# Altium schematic sheet Power_Supply.SchDoc: Power Supply
size A3; Author: M.Beldyga; CompanyName: WUT ISE; DrawnBy: M.Beldyga; Organization: WUT ISE; Address1: PW ISE; Address2: Nowowiejska 15/19 00-665 Warsaw; Address3: micbeldyga@gmail.com; SheetNumber: 2; SheetTotal: 7; ModifiedBy: -; CheckedDate: -; Title2: +/- 2kV, +/- 15V, 5V; DivGrp: WUT ISE; Designer: M.Beldyga; ModifiedDate: -; ProjectName: Sensor Box
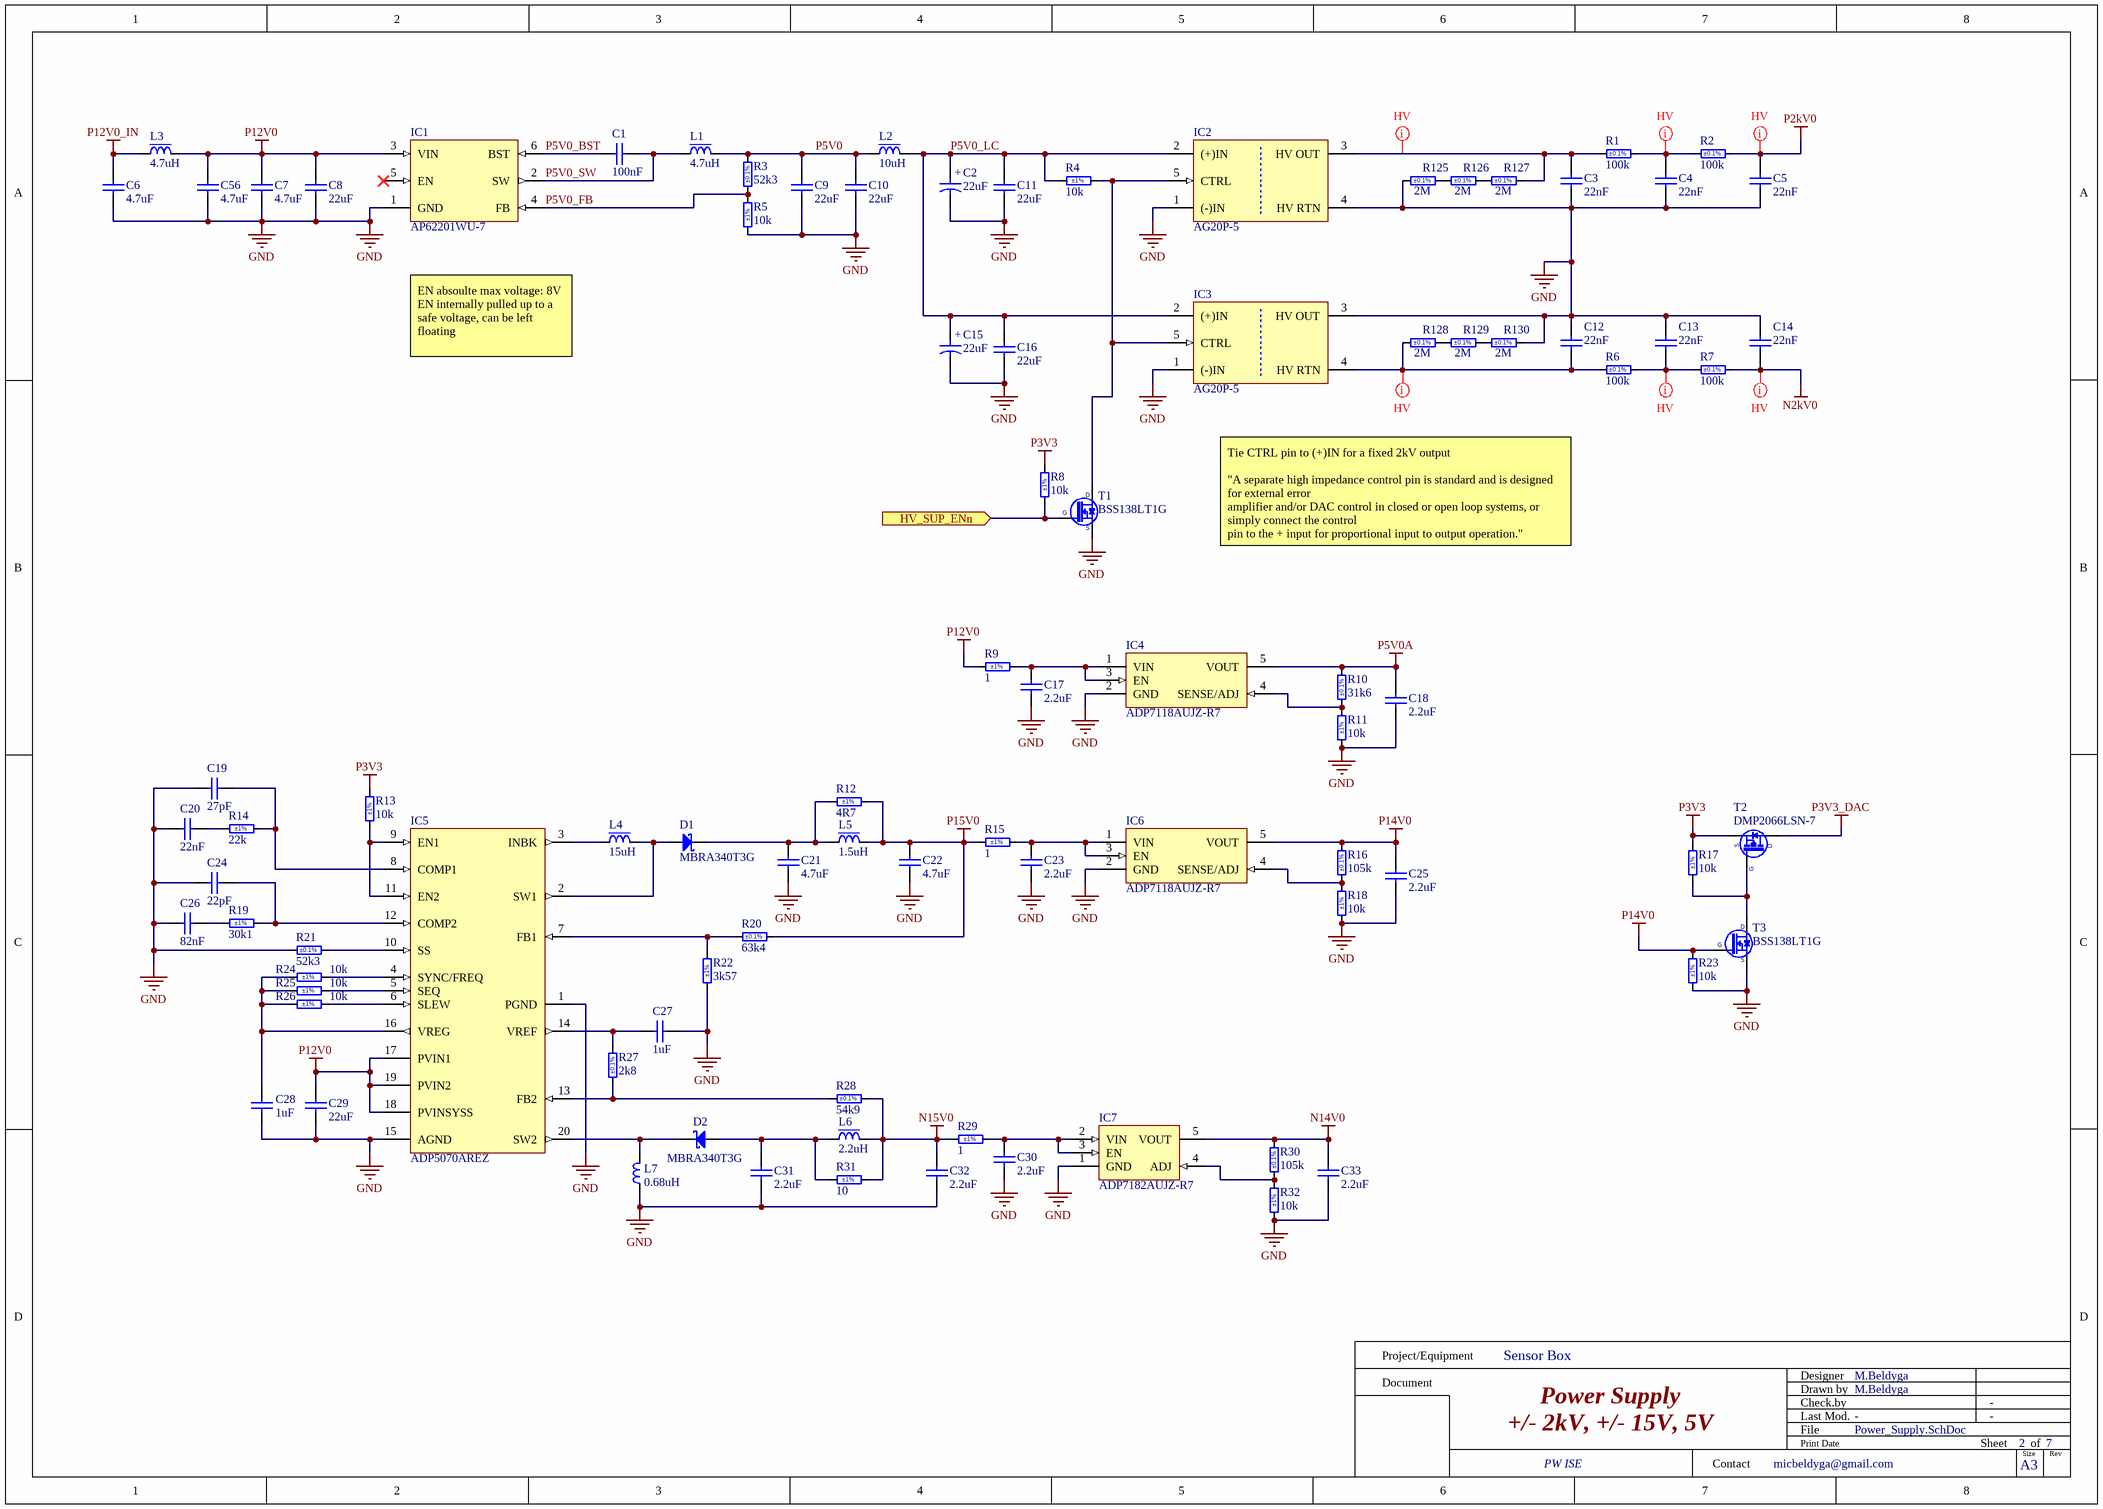
[diagram p0: Power_Supply.SchDoc]

## Parts
C1  100nF  [CAPC1005X55N]
C2  22uF  [CAPMP3528X210N]
C3  22nF  [CAPC5764X279N]
C4  22nF  [CAPC5764X279N]
C5  22nF  [CAPC5764X279N]
C6  4.7uF  [CAPC2012X145N]
C7  4.7uF  [CAPC2012X145N]
C8  22uF  [CAPC3216X180N]
C9  22uF  [CAPC2012X135N]
C10  22uF  [CAPC2012X135N]
C11  22uF  [CAPC3216X180N]
C12  22nF  [CAPC5764X279N]
C13  22nF  [CAPC5764X279N]
C14  22nF  [CAPC5764X279N]
C15  22uF  [CAPMP3528X210N]
C16  22uF  [CAPC3216X180N]
C17  2.2uF  [CAPC1005X55N]
C18  2.2uF  [CAPC1005X55N]
C19  27pF  [CAPC1005X55N]
C20  22nF  [CAPC1005X55N]
C21  4.7uF  [CAPC2012X145N]
C22  4.7uF  [CAPC2012X145N]
C23  2.2uF  [CAPC1005X55N]
C24  22pF  [CAPC1005X55N]
C25  2.2uF  [CAPC1005X55N]
C26  82nF  [CAPC1608X87N]
C27  1uF  [CAPC1005X55N]
C28  1uF  [CAPC1005X55N]
C29  22uF  [CAPC3216X180N]
C30  2.2uF  [CAPC1005X55N]
C31  2.2uF  [CAPC2013X145N]
C32  2.2uF  [CAPC2013X145N]
C33  2.2uF  [CAPC1005X55N]
C56  4.7uF  [CAPC2012X145N]
D1  MBRA340T3G  [DIOM5226X220N]
D2  MBRA340T3G  [DIOM5226X220N]
IC1  AP62201WU-7  [SOT95P280X100-6N]
IC2  AG20P-5  [DCDC_XPPOWER_AG0-2KV]
IC3  AG20P-5  [DCDC_XPPOWER_AG0-2KV]
IC4  ADP7118AUJZ-R7  [SOT95P280X90-5N]
IC5  ADP5070AREZ  [SOP65P640X120-21N-R305X425]
IC6  ADP7118AUJZ-R7  [SOT95P280X90-5N]
IC7  ADP7182AUJZ-R7  [SOT95P280X90-5N]
L1  4.7uH  [IND_WURTH_WE-SPC-4838]
L2  10uH  [IND_BOURNS_PM43]
L3  4.7uH  [IND_WURTH_WE-SPC-4838]
L4  15uH  [IND_WURTH_WE-SPC-4838]
L5  1.5uH  [IND_COILCRAFT_XAL4020]
L6  2.2uH  [IND_MURATA_LQH44PN_P0]
L7  0.68uH  [IND_BOURNS_SRP3212]
R1  100k  Tolerance: ±0.1%  [RESC3216X50N]
R2  100k  Tolerance: ±0.1%  [RESC3216X50N]
R3  52k3  Tolerance: ±0.1%  [RESC1608X55N]
R4  10k  Tolerance: ±1%  [RESC1005X40N]
R5  10k  Tolerance: ±1%  [RESC1005X40N]
R6  100k  Tolerance: ±0.1%  [RESC3216X50N]
R7  100k  Tolerance: ±0.1%  [RESC3216X50N]
R8  10k  Tolerance: ±1%  [RESC1005X40N]
R9  1  Tolerance: ±1%  [RESC1005X40N]
R10  31k6  Tolerance: ±0.1%  [RESC1005X35N]
R11  10k  Tolerance: ±1%  [RESC1005X40N]
R12  4R7  Tolerance: ±1%  [RESC1005X40N]
R13  10k  Tolerance: ±1%  [RESC1005X40N]
R14  22k  Tolerance: ±1%  [RESC1005X40N]
R15  1  Tolerance: ±1%  [RESC1005X40N]
R16  105k  Tolerance: ±0.1%  [RESC1608X55N]
R17  10k  Tolerance: ±1%  [RESC1005X40N]
R18  10k  Tolerance: ±1%  [RESC1005X40N]
R19  30k1  Tolerance: ±1%  [RESC1005X40N]
R20  63k4  Tolerance: ±0.1%  [RESC1608X55N]
R21  52k3  Tolerance: ±0.1%  [RESC1608X55N]
R22  3k57  Tolerance: ±1%  [RESC1608X55N]
R23  10k  Tolerance: ±1%  [RESC1005X40N]
R24  10k  Tolerance: ±1%  [RESC1005X40N]
R25  10k  Tolerance: ±1%  [RESC1005X40N]
R26  10k  Tolerance: ±1%  [RESC1005X40N]
R27  2k8  Tolerance: ±0.1%  [RESC1608X55N]
R28  54k9  Tolerance: ±0.1%  [RESC1608X55N]
R29  1  Tolerance: ±1%  [RESC1005X40N]
R30  105k  Tolerance: ±0.1%  [RESC1608X55N]
R31  10  Tolerance: ±1%  [RESC1005X40N]
R32  10k  Tolerance: ±1%  [RESC1005X40N]
R125  2M  Tolerance: ±0.1%  [RESC5025X65N]
R126  2M  Tolerance: ±0.1%  [RESC5025X65N]
R127  2M  Tolerance: ±0.1%  [RESC5025X65N]
R128  2M  Tolerance: ±0.1%  [RESC5025X65N]
R129  2M  Tolerance: ±0.1%  [RESC5025X65N]
R130  2M  Tolerance: ±0.1%  [RESC5025X65N]
T1  BSS138LT1G  [SOT95P240X110-3N]
T2  DMP2066LSN-7  [SOT95P285X140-3N]
T3  BSS138LT1G  [SOT95P240X110-3N]

## Ports
HV_SUP_ENn (in)

## Nets
GND: C2.2 C3.1 C4.1 C5.1 C6.1 C7.1 C8.1 C9.1 C10.1 C11.1 C12.2 C13.2 C14.2 C15.2 C16.1 C17.1 C18.1 C19.1 C20.1 C21.1 C22.1 C23.1 C24.1 C25.1 C26.1 C27.2 C28.1 C29.1 C30.1 C31.1 C32.1 C33.1 C56.1 IC1.1(GND) IC2.1((-)IN) IC2.4(HV_RTN) IC3.1((-)IN) IC3.3(HV_OUT) IC4.2(GND) IC5.1(PGND) IC5.15(AGND) IC6.2(GND) IC7.1(GND) L7.1 R5.1 R11.1 R18.1 R21.2 R22.1 R23.2 R32.1 R125.1 R130.2 T1.2(S) T3.2(S)
N2kV0: C14.1 R7.2
N14V0: C33.2 IC7.5(VOUT) R30.2
N15V0: C32.2 L6.2 R28.2 R29.1 R31.2
P2kV0: C5.2 R2.2
P3V3: R8.2 R13.2 R17.2 T2.2(S)
P3V3_DAC: T2.3(D)
P5V0A: C18.2 IC4.5(VOUT) R10.2
P12V0: C7.2 C8.2 C29.2 C56.2 IC1.3(VIN) IC5.17(PVIN1) IC5.18(PVINSYSS) IC5.19(PVIN2) L3.2 R9.1
P12V0_IN: C6.2 L3.1
P14V0: C25.2 IC6.5(VOUT) R16.2 R23.1 T3.1(G)
P15V0: C22.2 L5.2 R12.2 R15.1 R20.2
HV_SUP_ENn: R8.1 T1.1(G) ; port HV_SUP_ENn
P5V0: C9.2 C10.2 L1.2 L2.1 R3.2
P5V0_BST: C1.1 IC1.6(BST)
P5V0_FB: IC1.4(FB) R3.1 R5.2
P5V0_LC: C2.1 C11.2 C15.1 C16.2 IC2.2((+)IN) IC3.2((+)IN) L2.2 R4.1
P5V0_SW: C1.2 IC1.2(SW) L1.1
NetC3_2: C3.2 IC2.3(HV_OUT) R1.1 R127.2
NetC4_2: C4.2 R1.2 R2.1
NetC12_1: C12.1 IC3.4(HV_RTN) R6.1 R128.1
NetC13_1: C13.1 R6.2 R7.1
NetC17_2: C17.2 IC4.1(VIN) IC4.3(EN) R9.2
NetC19_2: C19.2 IC5.8(COMP1) R14.2
NetC20_2: C20.2 R14.1
NetC21_2: C21.2 D1.1(C) L5.1 R12.1
NetC23_2: C23.2 IC6.1(VIN) IC6.3(EN) R15.2
NetC24_2: C24.2 IC5.12(COMP2) R19.2
NetC26_2: C26.2 R19.1
NetC27_1: C27.1 IC5.14(VREF) R27.2
NetC28_2: C28.2 IC5.16(VREG) R24.2 R25.2 R26.2
NetC30_2: C30.2 IC7.2(VIN) IC7.3(EN) R29.2
NetC31_2: C31.2 D2.2(A) L6.1 R31.1
NetD1_2: D1.2(A) IC5.2(SW1) L4.2
NetD2_1: D2.1(C) IC5.20(SW2) L7.2
NetIC2_5: IC2.5(CTRL) IC3.5(CTRL) R4.2 T1.3(D)
NetIC4_4: IC4.4(SENSE/ADJ) R10.1 R11.2
NetIC5_3: IC5.3(INBK) L4.1
NetIC5_4: IC5.4(SYNC/FREQ) R24.1
NetIC5_5: IC5.5(SEQ) R25.1
NetIC5_6: IC5.6(SLEW) R26.1
NetIC5_7: IC5.7(FB1) R20.1 R22.2
NetIC5_9: IC5.9(EN1) IC5.11(EN2) R13.1
NetIC5_10: IC5.10(SS) R21.1
NetIC5_13: IC5.13(FB2) R27.1 R28.1
NetIC6_4: IC6.4(SENSE/ADJ) R16.1 R18.2
NetIC7_4: IC7.4(ADJ) R30.1 R32.2
NetR17_1: R17.1 T2.1(G) T3.3(D)
NetR125_2: R125.2 R126.1
NetR126_2: R126.2 R127.1
NetR128_2: R128.2 R129.1
NetR129_2: R129.2 R130.1

Not connected (* = marked no-connect by the designer): IC1 5(EN)*

## Layout directives
net class HV: N2kV0, NetC3_2, NetC4_2, NetC12_1, NetC13_1, P2kV0

## Notes on the sheet
- EN absoulte max voltage: 8V
  EN internally pulled up to a safe voltage, can be left floating
- Tie CTRL pin to (+)IN for a fixed 2kV output
  "A separate high impedance control pin is standard and is designed for external error
  amplifier and/or DAC control in closed or open loop systems, or simply connect the control
  pin to the + input for proportional input to output operation."
- Project/Equipment
- Document
- Designer
- Drawn by
- Check.by
- Contact
- File
- Last Mod.
- Print Date
- Sheet
- Size
- A3
- of
- Rev
- (in symbol CTE3528-21_22UF_20V_10%) +

## Library data of the parts
C1 = CC0402_100NF_50V_10%_X7R: Non-polarised capacitor; Part Description: SMD Multilayer Chip Ceramic Capacitor; Manufacturer: GENERIC; Manufacturer1 Part Number: GRM155R71H104KE14D; Voltage: 50V; TC: X7R; Tolerance: ±10%; Part Number: CC0402_100NF_50V_10%_X7R; Component Kind: Standard; Component Type: Standard; Pin Count: 2; Value: 100nF; Status: None; Manufacturer Part Number: CC0402_100NF_50V_10%_X7R; Case: 0402; Mounted: Yes; Socket: No; SMD: Yes; Sense: No; Manufacturer1 Example: MURATA; Manufacturer1 ComponentHeight: 0.55mm; HelpURL: \\cern.ch\dfs\Applications\Altium\Datasheets\CC0402_MURATA_GRM155R71H104KE14D.pdf; Author: CERN DEM MR; CreateDate: 6/30/2017; LatestRevisionDate: 6/30/2017
C2 C15 = CTE3528-21_22UF_20V_10%: Polarised capacitor; Part Description: Solid Tantalum Chip Capacitor; Manufacturer: GENERIC; Manufacturer1 Part Number: TAJB226K020R; Voltage: 20V; Tolerance: ±10%; Part Number: CTE3528-21_22UF_20V_10%; Component Kind: Standard; Component Type: Standard; Pin Count: 2; Value: 22uF; Status: Preferred; Manufacturer Part Number: CTE3528-21_22UF_20V_10%; Case: B; Mounted: Yes; Socket: No; SMD: Yes; Sense: No; Manufacturer1 Example: AVX; Manufacturer1 ComponentHeight: 2.1mm; HelpURL: \\cern.ch\dfs\Applications\Altium\Datasheets\CTE_AVX_TAJ.pdf; Author: CERN DEM JLC; CreateDate: 12/3/2007; LatestRevisionDate: 12/3/2007
C3-C5 C12-C14 = CC2225_22NF_2.5KV_10%_X7R: Non-polarised capacitor; Part Description: High Voltage MLC Chip Capacitor; Manufacturer: GENERIC; Manufacturer1 Part Number: 2225WC223KAT1A; Voltage: 2.5KV; TC: X7R; Tolerance: ±10%; Part Number: CC2225_22NF_2.5KV_10%_X7R; Component Kind: Standard; Component Type: Standard; Pin Count: 2; Value: 22nF; Status: None; Manufacturer Part Number: CC2225_22NF_2.5KV_10%_X7R; Case: 2225; Mounted: Yes; Socket: No; SMD: Yes; Sense: No; Manufacturer1 Example: AVX; Manufacturer1 ComponentHeight: 2.79mm; HelpURL: \\cern.ch\dfs\Applications\Altium\Datasheets\CC2225_X7R_AVX_HV-MLC.pdf; Author: CERN DEM JLC; CreateDate: 10/21/2014; LatestRevisionDate: 4/1/2015
C6 C7 C21 C22 C56 = CC0805_4.7UF_50V_10%_X7R: Non-polarised capacitor; Part Description: SMD Multilayer Chip Ceramic Capacitor; Manufacturer: GENERIC; Manufacturer1 Part Number: C2012X7R1H475K125; Voltage: 50V; TC: X7R; Tolerance: ±10%; Part Number: CC0805_4.7UF_50V_10%_X7R; Component Kind: Standard; Component Type: Standard; Pin Count: 2; Value: 4.7uF; Status: Preferred; Manufacturer Part Number: CC0805_4.7UF_50V_10%_X7R; Case: 0805; Mounted: Yes; Socket: No; SMD: Yes; Sense: No; Manufacturer1 Example: TDK; Manufacturer1 ComponentHeight: 1.45mm; HelpURL: \\cern.ch\dfs\Applications\Altium\Datasheets\CC0805_X7R_TDK_C.pdf; Author: CERN DEM JMW; CreateDate: 7/30/2021; LatestRevisionDate: 7/30/2021
C8 C11 C16 C29 = CC1206_22UF_25V_20%_X5R: Non-polarised capacitor; Part Description: SMD Multilayer Chip Ceramic Capacitor; Manufacturer: GENERIC; Manufacturer1 Part Number: C3216X5R1E226M160; Voltage: 25V; TC: X5R; Tolerance: ±20%; Part Number: CC1206_22UF_25V_20%_X5R; Component Kind: Standard; Component Type: Standard; Pin Count: 2; Value: 22uF; Status: None; Manufacturer Part Number: CC1206_22UF_25V_20%_X5R; Case: 1206; Mounted: Yes; Socket: No; SMD: Yes; Sense: No; Manufacturer1 Example: TDK; Manufacturer1 ComponentHeight: 1.8mm; HelpURL: \\cern.ch\dfs\Applications\Altium\Datasheets\CC1206_X5R_TDK_C.pdf; Author: CERN DEM WB; CreateDate: 7/25/2018; LatestRevisionDate: 7/25/2018
C9 C10 = CC0805_22UF_16V_10%_X5R: Non-polarised capacitor; Part Description: SMD Multilayer Chip Ceramic Capacitor; Manufacturer: GENERIC; Manufacturer1 Part Number: C2012X5R1C226KT; Voltage: 16V; TC: X5R; Tolerance: ±10%; Part Number: CC0805_22UF_16V_10%_X5R; Component Kind: Standard; Component Type: Standard; Pin Count: 2; Value: 22uF; Status: Preferred; Manufacturer Part Number: CC0805_22UF_16V_10%_X5R; Case: 0805; Mounted: Yes; Socket: No; SMD: Yes; Sense: No; Manufacturer1 Example: TDK; Manufacturer1 ComponentHeight: 1.35mm; HelpURL: \\cern.ch\dfs\Applications\Altium\Datasheets\CC0805_X5R_TDK_C.pdf; Author: CERN DEM JLC; CreateDate: 10/25/2012; LatestRevisionDate: 10/25/2012
C17 C18 C23 C25 C30 C33 = CC0402_2.2UF_16V_10%_X5R: Non-polarised capacitor; Part Description: SMD Multilayer Chip Ceramic Capacitor; Manufacturer: GENERIC; Manufacturer1 Part Number: C1005X5R1C225K050; Voltage: 16V; TC: X5R; Tolerance: ±10%; Part Number: CC0402_2.2UF_16V_10%_X5R; Component Kind: Standard; Component Type: Standard; Pin Count: 2; Value: 2.2uF; Status: Preferred; Manufacturer Part Number: CC0402_2.2UF_16V_10%_X5R; Case: 0402; Mounted: Yes; Socket: No; SMD: Yes; Sense: No; Manufacturer1 Example: TDK; Manufacturer1 ComponentHeight: 0.55mm; HelpURL: \\cern.ch\dfs\Applications\Altium\Datasheets\CC0402_X5R_TDK_C.pdf; Author: CERN DEM BC; CreateDate: 2/8/2021; LatestRevisionDate: 2/8/2021
C19 = CC0402_27PF_50V_5%_C0G: Non-polarised capacitor; Part Description: SMD Multilayer Chip Ceramic Capacitor; Manufacturer: GENERIC; Manufacturer1 Part Number: C0402C270J5GACTU; Voltage: 50V; TC: C0G/NP0; Tolerance: ±5%; Part Number: CC0402_27PF_50V_5%_C0G; Component Kind: Standard; Component Type: Standard; Pin Count: 2; Value: 27pF; Status: Preferred; Manufacturer Part Number: CC0402_27PF_50V_5%_C0G; Case: 0402; Mounted: Yes; Socket: No; SMD: Yes; Sense: No; Manufacturer1 Example: KEMET; Manufacturer1 ComponentHeight: 0.55mm; HelpURL: \\cern.ch\dfs\Applications\Altium\Datasheets\CC0402_C0G_KEMET_(Commercial Grade).pdf; Author: CERN DEM JLC; CreateDate: 10/25/2012; LatestRevisionDate: 4/22/2015
C20 = CC0402_22NF_16V_10%_X7R: Non-polarised capacitor; Part Description: SMD Multilayer Chip Ceramic Capacitor; Manufacturer: GENERIC; Manufacturer1 Part Number: 223878715641; Voltage: 16V; TC: X7R; Tolerance: ±10%; Part Number: CC0402_22NF_16V_10%_X7R; Component Kind: Standard; Component Type: Standard; Pin Count: 2; Value: 22nF; Status: Not Recommended; Manufacturer Part Number: CC0402_22NF_16V_10%_X7R; Case: 0402; Mounted: Yes; Socket: No; SMD: Yes; Sense: No; Manufacturer1 Example: PHYCOMP; Manufacturer1 ComponentHeight: 0.55mm; HelpURL: \\cern.ch\dfs\Applications\Altium\Datasheets\CC0402_X7R_PHYCOMP.pdf; Author: CERN DEM JLC; CreateDate: 12/3/2007; LatestRevisionDate: 12/3/2007
C24 = CC0402_22PF_50V_5%_C0G: Non-polarised capacitor; Part Description: SMD Multilayer Chip Ceramic Capacitor; Manufacturer: GENERIC; Manufacturer1 Part Number: C0402C220J5GACTU; Voltage: 50V; TC: C0G/NP0; Tolerance: ±5%; Part Number: CC0402_22PF_50V_5%_C0G; Component Kind: Standard; Component Type: Standard; Pin Count: 2; Value: 22pF; Status: Preferred; Manufacturer Part Number: CC0402_22PF_50V_5%_C0G; Case: 0402; Mounted: Yes; Socket: No; SMD: Yes; Sense: No; Manufacturer1 Example: KEMET; Manufacturer1 ComponentHeight: 0.55mm; HelpURL: \\cern.ch\dfs\Applications\Altium\Datasheets\CC0402_C0G_KEMET_(Commercial Grade).pdf; Author: CERN DEM JLC; CreateDate: 12/3/2007; LatestRevisionDate: 12/3/2007
C26 = CC0603_82NF_16V_10%_X7R: Non-polarised capacitor; Part Description: SMD Multilayer Chip Ceramic Capacitor; Manufacturer: GENERIC; Manufacturer1 Part Number: 223878615648; Voltage: 16V; TC: X7R; Tolerance: ±10%; Part Number: CC0603_82NF_16V_10%_X7R; Component Kind: Standard; Component Type: Standard; Pin Count: 2; Value: 82nF; Status: Preferred; Manufacturer Part Number: CC0603_82NF_16V_10%_X7R; Case: 0603; Mounted: Yes; Socket: No; SMD: Yes; Sense: No; Manufacturer1 Example: PHYCOMP; Manufacturer1 ComponentHeight: 0.87mm; HelpURL: \\cern.ch\dfs\Applications\Altium\Datasheets\CC0603_X7R_PHYCOMP.pdf; Author: CERN DEM JLC; CreateDate: 12/3/2007; LatestRevisionDate: 12/3/2007
C27 C28 = CC0402_1UF_16V_10%_X5R: Non-polarised capacitor; Part Description: SMD Multilayer Chip Ceramic Capacitor; Manufacturer: GENERIC; Manufacturer1 Part Number: C1005X5R1C105KT; Voltage: 16V; TC: X5R; Tolerance: ±10%; Part Number: CC0402_1UF_16V_10%_X5R; Component Kind: Standard; Component Type: Standard; Pin Count: 2; Value: 1uF; Status: Preferred; Manufacturer Part Number: CC0402_1UF_16V_10%_X5R; Case: 0402; Mounted: Yes; Socket: No; SMD: Yes; Sense: No; Manufacturer1 Example: TDK; Manufacturer1 ComponentHeight: 0.55mm; HelpURL: \\cern.ch\dfs\Applications\Altium\Datasheets\CC0402_X5R_TDK_C.pdf; Author: CERN DEM JLC
  C27: CreateDate: 10/25/2012; LatestRevisionDate: 10/25/2012
  C28: CreateDate: 25.10.2012; LatestRevisionDate: 25.10.2012
C31 C32 = CC0805_2.2UF_35V_10%_X7R: Non-polarised capacitor; Part Description: SMD Multilayer Chip Ceramic Capacitor; Manufacturer: GENERIC; Manufacturer Part Number: CGA4J1X7R1V225K125; Voltage: 35V; TC: X7R; Tolerance: ±10%; Part Number: CC0805_2.2UF_35V_10%_X7R; Component Kind: Standard; Component Type: Standard; Pin Count: 2; Value: 2.2uF; Status: Preferred; Case: 0805; Mounted: Yes; Socket: No; SMD: Yes; Sense: No; Manufacturer1 Example: TDK; Manufacturer1 Part Number: CGA4J1X7R1V225K125; Manufacturer1 ComponentHeight: 1.45mm; HelpURL: \\cern.ch\dfs\Applications\Altium\Datasheets\CC0805_X7R_TDK_CGA.pdf; Author: CERN DEM HF; CreateDate: 8/26/2022; LatestRevisionDate: 8/26/2022
D1 D2 = MBRA340T3G: Schottky Diode; Part Description: Schottky Power Rectifier; Manufacturer: ON SEMICONDUCTOR; Voltage: 40V; Power: 3A; PressFit: No; Bonding: No; Part Number: MBRA340T3G; Component Kind: Standard; Component Type: Standard; Device: MBRA340T3G; PackageDescription: DO-214-AC/SMA Diode, Molded Body; 5.21mm L X 2.60mm W X 2.20mm H, IPC Medium Density; Manufacturer Part Number: MBRA340T3; Pin Count: 2; Case: DO-214AC; Mounted: Yes; Socket: No; SMD: Yes; Sense: No; ComponentHeight: 2.20mm; HelpURL: \\cern.ch\dfs\Applications\Altium\Datasheets\MBRA340T3G.pdf; Author: CERN DEM JLC; CreateDate: 6/18/2012; LatestRevisionDate: 5/24/2022
IC1 = AP62201WU-7: 4.2V TO 18V INPUT, 2A LOW IQ SYNCHRONOUS BUCK CONVERTER; Manufacturer: DIODES INCORPORATED; PressFit: No; Bonding: No; Part Number: AP62201WU-7; Component Kind: Standard; Component Type: Standard; Device: AP62201WU-7; PackageDescription: SOT23, 0.95mm Pitch; 6 Pin, 1.625mm W X 2.90mm L X 1.00mm H body, IPC Medium Density; Part Description: 4.2V To 18V Input, 2A Low Iq Synchronous Buck Converter; Manufacturer Part Number: AP62201WU; Pin Count: 6; Case: SOT23-6; Mounted: Yes; Socket: No; SMD: Yes; Sense: No; ComponentHeight: 1.1mm; HelpURL: \\cern.ch\dfs\Applications\Altium\Datasheets\AP6220x.pdf; Author: CERN DEM HF; CreateDate: 1/7/2022; LatestRevisionDate: 3/21/2022
IC2 IC3 = AG20P-5: XP POWER, AG Series, DC/HVDC Converter; Part Description: 5VDC to 0-2kVDC, Iout (max) 0.5mA, 1W DC-HVDC Converter; PressFit: No; Bonding: No; Part Number: AG20P-5; Component Kind: Standard; Component Type: Standard; Device: AG20P-5; PackageDescription: AG Series, DC/HVDC Converter, Body W 11.43mm x L 23.37mm x H 6.35mm; Manufacturer: XP POWER; Manufacturer Part Number: AG20P-5; Pin Count: 5; Mounted: Yes; Socket: No; SMD: Yes; Sense: No; ComponentHeight: 3.3mm; HelpURL: \\cern.ch\dfs\Applications\Altium\Datasheets\XPPOWER_AG-Series.pdf; Author: CERN DEM BC; CreateDate: 9/18/2020; LatestRevisionDate: 9/18/2020
IC4 IC6 = ADP7118AUJZ-R7: Adjustable Positive LDO Regulator, 1.2V Min, 20V Max, 0.42V Dropout, CMOS, PDSO5; Manufacturer: Analog Devices; Output Voltage: 19.8V; Output Current: 200mA; Dropout Voltage: 200mV; Number of Regulators: 1; Min Current Limit: 250mA; Input Bias Current: 1uA; Min Input Voltage: 2.7V; Operating Supply Current: 180uA; Power Supply Rejection Ratio (PSRR): 50dB; Accuracy: 0.8%; Quiescent Current: 140uA; Max Output Voltage: 19.58V; Max Supply Current: 320uA; Supplier: Digikey; Supplier Part Number: 505-ADP7118AUJZ-R7CT-ND; Manufacturer Part Number: ADP7118AUJZ-R7; RoHS: Yes; Category: Voltage Regulators - Linear; Stock: 3209; Pricing: 1=2.73, 10=2.033, 25=1.8596, 100=1.6689, 250=1.57808, 500=1.52332, 1000=1.47827 (USD); Mounting Technology: Surface Mount; Case/Package: SOT-23-5; Pins: 5; Contact Plating: Tin,Matte; Min Operating Temperature: -40°C; Max Operating Temperature: 125°C; Packaging: Tape and Reel; Number of Outputs: 1; Max Supply Voltage: 20V; Package Quantity: 3000; Polarity: Positive; Max Output current: 200mA; Output Type: Adjustable; Series: -; Output Configuration: Positive; Min Output Voltage: 1.2V; Lead Free: Contains Lead; RoHS Compliant: Yes; ComponentLink1URL: http://www.farnell.com/datasheets/2250589.pdf?src-supplier=Farnell; ComponentLink1Description: http://www.farnell.com/datasheets/2250589.pdf?src-supplier=Farnell; ComponentLink2URL: http://www.mouser.com/ds/2/609/ADP7118-876130.pdf?src-supplier=Mouser; ComponentLink2Description: http://www.mouser.com/ds/2/609/ADP7118-876130.pdf?src-supplier=Mouser; ComponentLink3URL: https://www.analog.com/media/en/technical-documentation/data-sheets/ADP7118.pdf?src-supplier=Digikey; ComponentLink3Description: https://www.analog.com/media/en/technical-documentation/data-sheets/ADP7118.pdf?src-supplier=Digikey; ComponentLink4URL: http://www.analog.com/static/imported-files/data_sheets/ADP7118.pdf?src-supplier=Avnet; ComponentLink4Description: http://www.analog.com/static/imported-files/data_sheets/ADP7118.pdf?src-supplier=Avnet; ComponentLink5URL: https://datasheet.octopart.com/ADP7118AUJZ-R7-Analog-Devices-datasheet-80865365.pdf?src-supplier=Newark; ComponentLink5Description: https://datasheet.octopart.com/ADP7118AUJZ-R7-Analog-Devices-datasheet-80865365.pdf?src-supplier=Newark; ComponentLink6URL: https://datasheet.octopart.com/ADP7118AUJZ-R7-Analog-Devices-datasheet-140248909.pdf?src-supplier=Element14; ComponentLink6Description: https://datasheet.octopart.com/ADP7118AUJZ-R7-Analog-Devices-datasheet-140248909.pdf?src-supplier=Element14; ComponentLink7URL: https://datasheet.octopart.com/ADP7118AUJZ-R7-Analog-Devices-datasheet-140566823.pdf?src-supplier=Arrow.cn; ComponentLink7Description: https://datasheet.octopart.com/ADP7118AUJZ-R7-Analog-Devices-datasheet-140566823.pdf?src-supplier=Arrow.cn
IC5 = ADP5070AREZ: 1A/0.6A, DC-to-DC Switching Regulator with Independent Positive and Negative Outputs; Manufacturer: ANALOG DEVICES; PressFit: No; Bonding: No; Part Number: ADP5070AREZ; Component Kind: Standard; Component Type: Standard; Device: ADP5070AREZ; PackageDescription: SOP, 0.65mm Pitch; 20 Pin, 4.40mm W X 6.50mm L X 1.20mm H Body (w/Thermal Tab 3.05mm X 4.25mm), IPC Medium Density; Part Description: 1A/0.6A, DC-to-DC Switching Regulator with Independent Positive and Negative Outputs; Manufacturer Part Number: ADP5070ARE; Pin Count: 20; Case: SSOP20; Mounted: Yes; Socket: No; SMD: Yes; Sense: No; ComponentHeight: 1.2mm; HelpURL: \\cern.ch\dfs\Applications\Altium\Datasheets\ADP5070AREZ.pdf; Author: CERN DEM JLC; CreateDate: 6/21/2017; LatestRevisionDate: 4/1/2022
IC7 = ADP7182AUJZ-R7: -1.22V to -27V, -200mA, Adjustable, Low Noise, Negative Linear Regulator; Manufacturer: ANALOG DEVICES; PressFit: No; Bonding: No; Part Number: ADP7182AUJZ-R7; Component Kind: Standard; Component Type: Standard; Device: ADP7182AUJZ-R7; PackageDescription: SOT23, 0.95mm Pitch; 5 Pin, 1.75mm W X 3.00mm L X 0.90mm H body, IPC Medium Density; Part Description: -1.22V to -27V, -200mA, Adjustable, Low Noise, Negative Linear Regulator; Manufacturer Part Number: ADP7182AUJ; Pin Count: 5; Case: SOT23-5; Mounted: Yes; Socket: No; SMD: Yes; Sense: No; ComponentHeight: 0.9mm; HelpURL: \\cern.ch\dfs\Applications\Altium\Datasheets\ADP7182AUJZ-R7.pdf; Author: CERN DEM JLC; CreateDate: 6/16/2014; LatestRevisionDate: 4/4/2022
L1 L3 = IND_4.7UH_20%_WURTH_WE-SPC_74408943047: Inductor With Core; Part Description: SMD Shielded Power Inductor (WE-SPC Series); Manufacturer: WURTH ELEKTRONIK; Power: 2.2A; Resistance: 0.045R; Tolerance: ±20%; Part Number: IND_4.7UH_20%_WURTH_WE-SPC_74408943047; Component Kind: Standard; Component Type: Standard; Pin Count: 2; Value: 4.7uH; Manufacturer Part Number: 74408943047; Mounted: Yes; Socket: No; SMD: Yes; Sense: No; ComponentHeight: 4.1mm; HelpURL: \\cern.ch\dfs\Applications\Altium\Datasheets\IND_WURTH_WE-SPC_74408943047.pdf; Author: CERN DEM JLC; CreateDate: 11/24/2014; LatestRevisionDate: 7/5/2017
L2 = IND_10UH_20%_BOURNS_PM43: Inductor With Core; Part Description: SMD Power Inductor; Manufacturer: BOURNS; Manufacturer Part Number: PM43-100M-RC; Power: 1.15A; Resistance: 0.18R; Tolerance: ±20%; Part Number: IND_10UH_20%_BOURNS_PM43; Component Kind: Standard; Component Type: Standard; Pin Count: 2; Value: 10uH; Mounted: Yes; Socket: No; SMD: Yes; Sense: No; ComponentHeight: 3.5mm; HelpURL: \\cern.ch\dfs\Applications\Altium\Datasheets\IND_BOURNS_PM43.pdf; Author: CERN DEM JLC; CreateDate: 5/17/2011; LatestRevisionDate: 5/17/2011
L4 = IND_15UH_20%_WURTH_WE-SPC_74408943150: Inductor With Core; Part Description: SMD Shielded Power Inductor (WE-SPC Series); Manufacturer: WURTH ELEKTRONIK; Power: 1.4A; Resistance: 0.118R; Tolerance: ±20%; Part Number: IND_15UH_20%_WURTH_WE-SPC_74408943150; Component Kind: Standard; Component Type: Standard; Pin Count: 2; Value: 15uH; Manufacturer Part Number: 74408943150; Mounted: Yes; Socket: No; SMD: Yes; Sense: No; ComponentHeight: 4.1mm; HelpURL: \\cern.ch\dfs\Applications\Altium\Datasheets\IND_WURTH_WE-SPC_74408943150.pdf; Author: CERN DEM MR; CreateDate: 6/30/2017; LatestRevisionDate: 7/5/2017
L5 = IND_1.5UH_20%_COILCRAFT_XAL4020: Inductor With Core; Part Description: SMD Shielded Power Inductor; Manufacturer Part Number: XAL4020-152ME; Power: 5.2A; Resistance: 0.02145R; Tolerance: ±20%; Part Number: IND_1.5UH_20%_COILCRAFT_XAL4020; Component Kind: Standard; Component Type: Standard; Pin Count: 2; Value: 1.5uH; Manufacturer: COILCRAFT; Mounted: Yes; Socket: No; SMD: Yes; Sense: No; ComponentHeight: 2.1mm; HelpURL: \\cern.ch\dfs\Applications\Altium\Datasheets\IND_COILCRAFT_XAL4020.pdf; Author: CERN DEM BC; CreateDate: 8/7/2019; LatestRevisionDate: 8/31/2023
L6 = IND_2.2UH_20%_MURATA_LQH44PN2R2MP0L: Inductor With Core; Part Description: Wire Wound Ferrite Inductor for Power Lines; Manufacturer: MURATA; Power: 1.8A; Resistance: 0R049; Tolerance: ±20%; Part Number: IND_2.2UH_20%_MURATA_LQH44PN2R2MP0L; Component Kind: Standard; Component Type: Standard; Pin Count: 2; Value: 2.2uH; Manufacturer Part Number: LQH44PN2R2MP0L; Case: 4040; Mounted: Yes; Socket: No; SMD: Yes; Sense: No; ComponentHeight: 1.8mm; HelpURL: \\cern.ch\dfs\Applications\Altium\Datasheets\IND_MURATA_LQH44PN_P0.pdf; Author: CERN DEM JLC; CreateDate: 2/14/2018; LatestRevisionDate: 2/14/2018
L7 = IND_0.68UH_20%_BOURNS_SRP3212: Inductor; Part Description: Shielded SMD Power Inductor; Manufacturer: BOURNS; Manufacturer Part Number: SRP3212-R68M; Power: 6.2A; Resistance: 0.020R; Tolerance: ±20%; Part Number: IND_0.68UH_20%_BOURNS_SRP3212; Component Kind: Standard; Component Type: Standard; Pin Count: 2; Value: 0.68uH; Mounted: Yes; Socket: No; SMD: Yes; Sense: No; ComponentHeight: 1.2mm; HelpURL: \\cern.ch\dfs\Applications\Altium\Datasheets\IND_BOURNS_SRP3212.pdf; Author: CERN DEM HF; CreateDate: 6/23/2022; LatestRevisionDate: 6/23/2022
R1 R2 R6 R7 = R1206_100K_0.1%_0.4W_25PPM_VISHAY_PAT: Resistor - 0.1%; Part Description: Precision Automotive Thin Film Chip Resistor 2kV ESD Rating; Manufacturer: VISHAY DALE THIN FILM; Manufacturer Part Number: PAT1206E1003BS; Power: 0.4W; TC: ±25ppm/°C; PressFit: No; Part Number: R1206_100K_0.1%_0.4W_25PPM_VISHAY_PAT; Component Kind: Standard; Component Type: Standard; Pin Count: 2; Value: 100k; Status: Not Recommended; Case: 1206; Mounted: Yes; Sense: No; Socket: No; SMD: Yes; ComponentHeight: 0.5mm; HelpURL: \\cern.ch\dfs\Applications\Altium\Datasheets\R1206_VISHAY_PAT.pdf; Author: CERN DEM MR; CreateDate: 7/19/2016; LatestRevisionDate: 6/28/2022
R3 R21 = R0603_52K3_0.1%_0.063W_10PPM: Resistor - 0.1%; Part Description: Thin Film Chip Resistor; Manufacturer: GENERIC; Manufacturer1 Part Number: RN73C1J52K3BTDF; Power: 0.063W; TC: ±10ppm; PressFit: No; Part Number: R0603_52K3_0.1%_0.063W_10PPM; Component Kind: Standard; Component Type: Standard; Pin Count: 2; Value: 52k3; Status: Not Recommended; Manufacturer Part Number: R0603_52K3_0.1%_0.063W_10PPM; Case: 0603; Mounted: Yes; Sense: No; Socket: No; SMD: Yes; Manufacturer1 Example: TYCO HOLSWORTHY; Manufacturer1 ComponentHeight: 0.5mm; HelpURL: \\cern.ch\dfs\Applications\Altium\Datasheets\R0603_Tyco_RN73.pdf; Author: CERN DEM JLC; CreateDate: 12/3/2007; LatestRevisionDate: 3/13/2008
R4 R5 R8 R11 R13 R17 R18 R23-R26 R32 = R0402_10K_1%_0.0625W_100PPM: Resistor - 1%; Part Description: General Purpose Thick Film Chip Resistor; Manufacturer: GENERIC; Manufacturer1 Part Number: 232270671003L; TC: ±100ppm/°C; PressFit: No; Part Number: R0402_10K_1%_0.0625W_100PPM; Component Kind: Standard; Component Type: Standard; Pin Count: 2; Value: 10k; Status: Not Recommended; Power: 0.0625W; Manufacturer Part Number: R0402_10K_1%_0.0625W_100PPM; Case: 0402; Mounted: Yes; Sense: No; Socket: No; SMD: Yes; Manufacturer1 Example: YAGEO PHYCOMP; Manufacturer1 ComponentHeight: 0.4mm; HelpURL: \\cern.ch\dfs\Applications\Altium\Datasheets\R0402_Phycomp_RC0402.pdf; Author: CERN DEM JLC; CreateDate: 12/3/2007; LatestRevisionDate: 10/17/2012
R9 R15 R29 = R0402_1R_1%_0.0625W_200PPM: Resistor - 1%; Part Description: General Purpose Thick Film Chip Resistor; Manufacturer: GENERIC; Manufacturer1 Part Number: 232270671008L; TC: ±200ppm/°C; PressFit: No; Part Number: R0402_1R_1%_0.0625W_200PPM; Component Kind: Standard; Component Type: Standard; Pin Count: 2; Value: 1; Status: Not Recommended; Power: 0.0625W; Manufacturer Part Number: R0402_1R_1%_0.0625W_200PPM; Case: 0402; Mounted: Yes; Sense: No; Socket: No; SMD: Yes; Manufacturer1 Example: YAGEO PHYCOMP; Manufacturer1 ComponentHeight: 0.4mm; HelpURL: \\cern.ch\dfs\Applications\Altium\Datasheets\R0402_Phycomp_RC0402.pdf; Author: CERN DEM JLC; CreateDate: 12/3/2007; LatestRevisionDate: 10/17/2012
R10 = R0402_31K6_0.1%_0.063W_25PPM_YAGEO_RT: Resistor - 0.1%; Part Description: Thin Film Chip Resistor; Manufacturer: YAGEO; Manufacturer Part Number: RT0402BRD0731K6L; Power: 0.063W; TC: ±25ppm/°C; Voltage: 50V; PressFit: No; Part Number: R0402_31K6_0.1%_0.063W_25PPM_YAGEO_RT; Component Kind: Standard; Component Type: Standard; Pin Count: 2; Value: 31k6; Status: Not Recommended; Case: 0402; Mounted: Yes; Sense: No; Socket: No; SMD: Yes; ComponentHeight: 0.35mm; HelpURL: \\cern.ch\dfs\Applications\Altium\Datasheets\R0402_YAGEO_RT.pdf; Author: CERN DEM BC; CreateDate: 7/30/2020; LatestRevisionDate: 7/30/2020
R12 = R0402_4R7_1%_0.0625W_200PPM: Resistor - 1%; Part Description: General Purpose Thick Film Chip Resistor; Manufacturer: GENERIC; Manufacturer1 Part Number: 232270674708L; TC: ±200ppm/°C; PressFit: No; Part Number: R0402_4R7_1%_0.0625W_200PPM; Component Kind: Standard; Component Type: Standard; Pin Count: 2; Value: 4R7; Status: Not Recommended; Power: 0.0625W; Manufacturer Part Number: R0402_4R7_1%_0.0625W_200PPM; Case: 0402; Mounted: Yes; Sense: No; Socket: No; SMD: Yes; Manufacturer1 Example: YAGEO PHYCOMP; Manufacturer1 ComponentHeight: 0.4mm; HelpURL: \\cern.ch\dfs\Applications\Altium\Datasheets\R0402_Phycomp_RC0402.pdf; Author: CERN DEM JLC; CreateDate: 12/3/2007; LatestRevisionDate: 10/17/2012
R14 = R0402_22K_1%_0.0625W_100PPM: Resistor - 1%; Part Description: General Purpose Thick Film Chip Resistor; Manufacturer: GENERIC; Manufacturer1 Part Number: 232270672203L; TC: ±100ppm/°C; PressFit: No; Part Number: R0402_22K_1%_0.0625W_100PPM; Component Kind: Standard; Component Type: Standard; Pin Count: 2; Value: 22k; Status: Not Recommended; Power: 0.0625W; Manufacturer Part Number: R0402_22K_1%_0.0625W_100PPM; Case: 0402; Mounted: Yes; Sense: No; Socket: No; SMD: Yes; Manufacturer1 Example: YAGEO PHYCOMP; Manufacturer1 ComponentHeight: 0.4mm; HelpURL: \\cern.ch\dfs\Applications\Altium\Datasheets\R0402_Phycomp_RC0402.pdf; Author: CERN DEM JLC; CreateDate: 12/3/2007; LatestRevisionDate: 10/17/2012
R16 R30 = R0603_105K_0.1%_0.063W_10PPM: Resistor - 0.1%; Part Description: Thin Film Chip Resistor; Manufacturer: GENERIC; Manufacturer1 Part Number: RN73C1J105KBTDF; Power: 0.063W; TC: ±10ppm; PressFit: No; Part Number: R0603_105K_0.1%_0.063W_10PPM; Component Kind: Standard; Component Type: Standard; Pin Count: 2; Value: 105k; Status: Not Recommended; Manufacturer Part Number: R0603_105K_0.1%_0.063W_10PPM; Case: 0603; Mounted: Yes; Sense: No; Socket: No; SMD: Yes; Manufacturer1 Example: TYCO HOLSWORTHY; Manufacturer1 ComponentHeight: 0.5mm; HelpURL: \\cern.ch\dfs\Applications\Altium\Datasheets\R0603_Tyco_RN73.pdf; Author: CERN DEM JLC; CreateDate: 12/3/2007; LatestRevisionDate: 3/13/2008
R19 = R0402_30K1_1%_0.0625W_100PPM: Resistor - 1%; Part Description: General Purpose Thick Film Chip Resistor; Manufacturer: GENERIC; Manufacturer1 Part Number: RC0402FR-0730K1L; TC: ±100ppm/°C; PressFit: No; Part Number: R0402_30K1_1%_0.0625W_100PPM; Component Kind: Standard; Component Type: Standard; Pin Count: 2; Value: 30k1; Status: Preferred; Power: 0.0625W; Manufacturer Part Number: R0402_30K1_1%_0.0625W_100PPM; Case: 0402; Mounted: Yes; Sense: No; Socket: No; SMD: Yes; Manufacturer1 Example: YAGEO PHYCOMP; Manufacturer1 ComponentHeight: 0.4mm; HelpURL: \\cern.ch\dfs\Applications\Altium\Datasheets\R0402_YAGEO_RC_L.pdf; Author: CERN DEM BC; CreateDate: 3/16/2021; LatestRevisionDate: 3/16/2021
R20 = R0603_63K4_0.1%_0.063W_10PPM: Resistor - 0.1%; Part Description: Thin Film Chip Resistor; Manufacturer: GENERIC; Manufacturer1 Part Number: RN73C1J63K4BTDF; Power: 0.063W; TC: ±10ppm; PressFit: No; Part Number: R0603_63K4_0.1%_0.063W_10PPM; Component Kind: Standard; Component Type: Standard; Pin Count: 2; Value: 63k4; Status: Not Recommended; Manufacturer Part Number: R0603_63K4_0.1%_0.063W_10PPM; Case: 0603; Mounted: Yes; Sense: No; Socket: No; SMD: Yes; Manufacturer1 Example: TYCO HOLSWORTHY; Manufacturer1 ComponentHeight: 0.5mm; HelpURL: \\cern.ch\dfs\Applications\Altium\Datasheets\R0603_Tyco_RN73.pdf; Author: CERN DEM JLC; CreateDate: 12/3/2007; LatestRevisionDate: 3/13/2008
R22 = R0603_3K57_1%_0.063W_50PPM: Resistor - 1%; Part Description: General Purpose Thick Film Chip Resistor; Manufacturer: GENERIC; Manufacturer1 Part Number: CPF0603F3K57C1; Power: 0.063W; TC: ±50ppm/°C; PressFit: No; Part Number: R0603_3K57_1%_0.063W_50PPM; Component Kind: Standard; Component Type: Standard; Pin Count: 2; Value: 3k57; Status: None; Manufacturer Part Number: R0603_3K57_1%_0.063W_50PPM; Case: 0603; Mounted: Yes; Sense: No; Socket: No; SMD: Yes; Manufacturer1 Example: TYCO NEOHM; Manufacturer1 ComponentHeight: 0.55mm; HelpURL: \\cern.ch\dfs\Applications\Altium\Datasheets\R0603_TYCO_CPF.pdf; Author: CERN DEM JLC; CreateDate: 5/20/2010; LatestRevisionDate: 5/20/2010
R27 = R0603_2K8_0.1%_0.063W_10PPM: Resistor - 0.1%; Part Description: Thin Film Chip Resistor; Manufacturer: GENERIC; Manufacturer1 Part Number: RN73C1J2K8BTDF; Power: 0.063W; TC: ±10ppm; PressFit: No; Part Number: R0603_2K8_0.1%_0.063W_10PPM; Component Kind: Standard; Component Type: Standard; Pin Count: 2; Value: 2k8; Status: Not Recommended; Manufacturer Part Number: R0603_2K8_0.1%_0.063W_10PPM; Case: 0603; Mounted: Yes; Sense: No; Socket: No; SMD: Yes; Manufacturer1 Example: TYCO HOLSWORTHY; Manufacturer1 ComponentHeight: 0.5mm; HelpURL: \\cern.ch\dfs\Applications\Altium\Datasheets\R0603_Tyco_RN73.pdf; Author: CERN DEM JLC; CreateDate: 12/3/2007; LatestRevisionDate: 3/13/2008
R28 = R0603_54K9_0.1%_0.063W_10PPM: Resistor - 0.1%; Part Description: Thin Film Chip Resistor; Manufacturer: GENERIC; Manufacturer1 Part Number: RN73C1J54K9BTDF; Power: 0.063W; TC: ±10ppm; PressFit: No; Part Number: R0603_54K9_0.1%_0.063W_10PPM; Component Kind: Standard; Component Type: Standard; Pin Count: 2; Value: 54k9; Status: Not Recommended; Manufacturer Part Number: R0603_54K9_0.1%_0.063W_10PPM; Case: 0603; Mounted: Yes; Sense: No; Socket: No; SMD: Yes; Manufacturer1 Example: TYCO HOLSWORTHY; Manufacturer1 ComponentHeight: 0.5mm; HelpURL: \\cern.ch\dfs\Applications\Altium\Datasheets\R0603_Tyco_RN73.pdf; Author: CERN DEM JLC; CreateDate: 12/3/2007; LatestRevisionDate: 3/13/2008
R31 = R0402_10R_1%_0.0625W_200PPM: Resistor - 1%; Part Description: General Purpose Thick Film Chip Resistor; Manufacturer: GENERIC; Manufacturer1 Part Number: 232270671009L; TC: ±200ppm/°C; PressFit: No; Part Number: R0402_10R_1%_0.0625W_200PPM; Component Kind: Standard; Component Type: Standard; Pin Count: 2; Value: 10; Status: Not Recommended; Power: 0.0625W; Manufacturer Part Number: R0402_10R_1%_0.0625W_200PPM; Case: 0402; Mounted: Yes; Sense: No; Socket: No; SMD: Yes; Manufacturer1 Example: YAGEO PHYCOMP; Manufacturer1 ComponentHeight: 0.4mm; HelpURL: \\cern.ch\dfs\Applications\Altium\Datasheets\R0402_Phycomp_RC0402.pdf; Author: CERN DEM JLC; CreateDate: 6/24/2009; LatestRevisionDate: 10/17/2012
R125-R130 = R1210_2M0_0.1%_1/3W_25ppm: RES, HV, 2010, 2 Mohm, 0.1%, 25 ppm, 1W; Part Description: Thick Film Chip Resistor; Manufacturer: Vishay Dale; Manufacturer Part Number: TNPV12102M00BEEA; Power: 1/3W; TC: ±25ppm/°C; PressFit: No; Part Number: R1210_2M0_0.1%_1/3W_25ppm; Component Kind: Standard; Component Type: Standard; Pin Count: 2; Value: 2M; Status: None; Case: 2010; Mounted: Yes; Sense: No; Socket: No; SMD: Yes; Manufacturer1 ComponentHeight: 0.65mm; HelpURL: \\cern.ch\dfs\Applications\Altium\Datasheets\R2010_WELWYN_LHVC.pdf; Author: GK; CreateDate: 26.02.2015; LatestRevisionDate: 26.02.2015
T1 T3 = BSS138LT1G: N-CHANNEL MOSFET WITH DIODE; Part Description: 50V, 200mA N-Channel Enhancement Mode Field-Effect Transistor; Manufacturer: ON SEMICONDUCTOR; PressFit: No; Bonding: No; Part Number: BSS138LT1G; Component Kind: Standard; Component Type: Standard; Device: BSS138LT1G; PackageDescription: SOT23, 0.95mm Pitch; 3 Pin, 1.40mm W X 3.00mm L X 1.10mm H body, IPC Medium Density; Manufacturer Part Number: BSS138L; Pin Count: 3; Case: SOT23-3; Mounted: Yes; Socket: No; SMD: Yes; Sense: No; ComponentHeight: 1.11mm; HelpURL: \\cern.ch\dfs\Applications\Altium\Datasheets\BSS138LT1G.pdf; Author: CERN DEM JLC; CreateDate: 3/23/2009; LatestRevisionDate: 5/25/2022
T2 = DMP2066LSN-7: P-CHANNEL MOSFET WITH DIODE; Part Description: 20V, 4.6A, P-Channel Enhancement Mode MOSFET; Manufacturer: DIODES INCORPORATED; PressFit: No; Bonding: No; Part Number: DMP2066LSN-7; Component Kind: Standard; Component Type: Standard; Device: DMP2066LSN-7; PackageDescription: SOT, 0.95mm Pitch; 3 Pin, 1.60mm W X 3.00mm L X 1.40mm H body, IPC Medium Density; Manufacturer Part Number: DMP2066LSN-7; Pin Count: 3; Case: SOT23-3; Mounted: Yes; Socket: No; SMD: Yes; Sense: No; ComponentHeight: 1.4mm; HelpURL: \\cern.ch\dfs\Applications\Altium\Datasheets\DMP2066LSN-7.pdf; Author: CERN DEM JLC; CreateDate: 11/17/2014; LatestRevisionDate: 11/17/2014